# EAGLE design reflow_ofen (EAGLE 6.4)
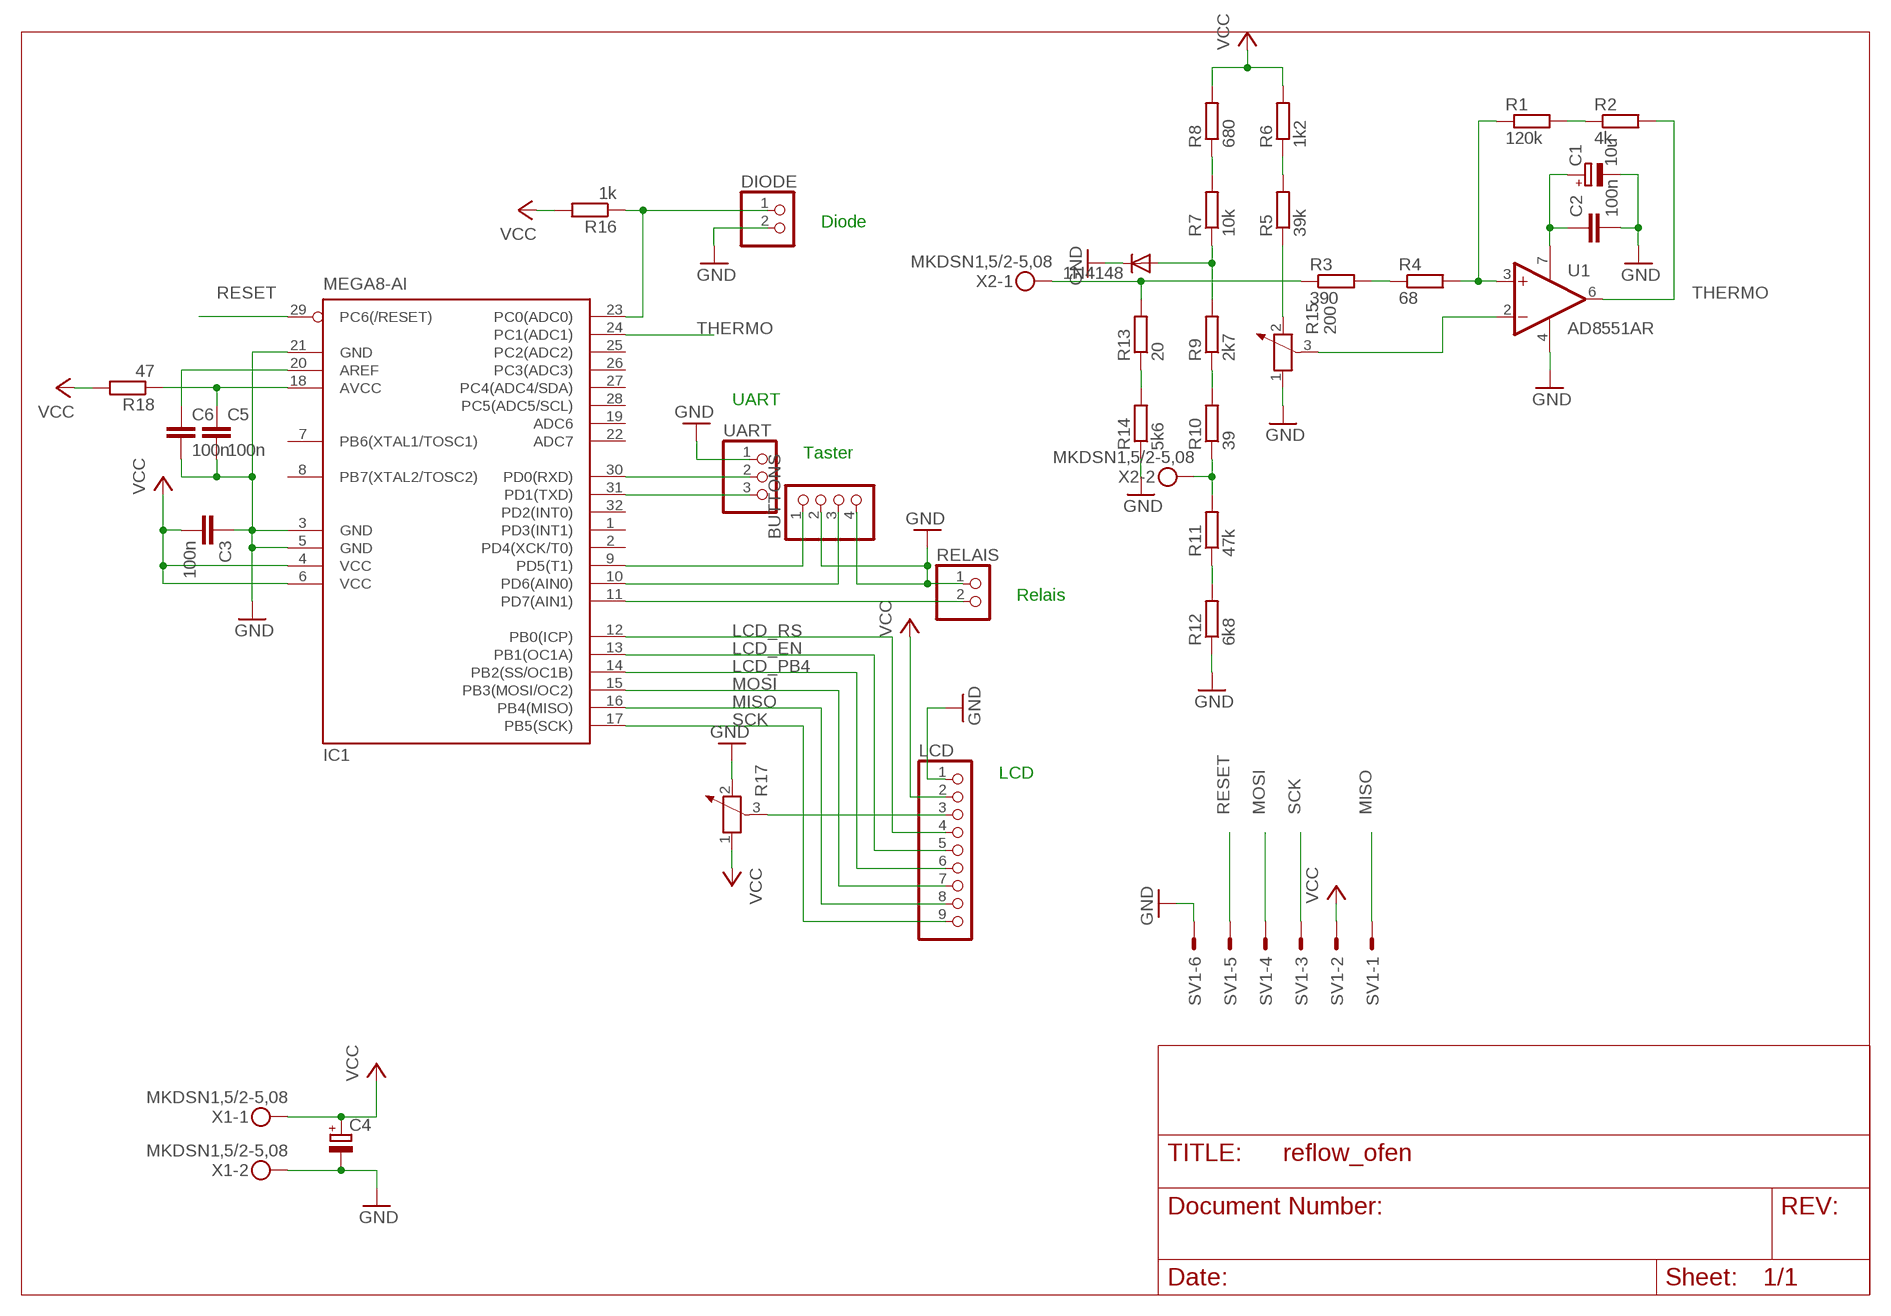
[diagram p0: schematic, sheet 1]

## Parts
1N4148  DIODE-SOD80C  [SOD80C]
BUTTONS  PINHD-1X4  [1X04]
C1  10u  CPOL-EU153CLV-0405  [153CLV-0405]
C2  100n  C-EUC0805  [C0805]
C3  100n  C-EUC0805  [C0805]
C4  CPOL-EU153CLV-0505  [153CLV-0505]
C5  100n  C-EUC0805  [C0805]
C6  100n  C-EUC0805  [C0805]
DIODE  PINHD-1X2  [1X02]
IC1  MEGA8-AI  [TQFP32-08]
LCD  PINHD-1X9  [1X09]
R1  120k  R-EU_R0805  [R0805]
R2  4k  R-EU_R0805  [R0805]
R3  390  R-EU_R0805  [R0805]
R4  68  R-EU_R0805  [R0805]
R5  39k  R-EU_R0805  [R0805]
R6  1k2  R-EU_R0805  [R0805]
R7  10k  R-EU_R0805  [R0805]
R8  680  R-EU_R0805  [R0805]
R9  2k7  R-EU_R0805  [R0805]
R10  39  R-EU_R0805  [R0805]
R11  47k  R-EU_R0805  [R0805]
R12  6k8  R-EU_R0805  [R0805]
R13  20  R-EU_R0805  [R0805]
R14  5k6  R-EU_R0805  [R0805]
R15  200  POTENTIOMETER_PT-10  [PT-10]
R16  1k  R-EU_R0805  [R0805]
R17  POTENTIOMETER_PT-10  [PT-10]
R18  47  R-EU_R0805  [R0805]
RELAIS  PINHD-1X2  [1X02]
SV1  ML6E  [ML6]
U1  AD8551AR  [SO8]
UART  PINHD-1X3  [1X03]
X1  MKDSN1,5/2-5,08  [MKDSN1,5/2-5,08]
X2  MKDSN1,5/2-5,08  [MKDSN1,5/2-5,08]

## Nets
GND: 1N4148.C BUTTONS.2 BUTTONS.4 C1.- C2.2 C3.1 C4.- C5.2 C6.2 DIODE.2 IC1.3(GND) IC1.5(GND) IC1.21(GND) LCD.1 R12.1 R14.1 R15.1 R17.2 RELAIS.1 SV1.6 U1.4(GND) UART.1 X1.2
LCD_EN: IC1.13(PB1(OC1A)) LCD.5
LCD_PB4: IC1.14(PB2(SS/OC1B)) LCD.6
LCD_RS: IC1.12(PB0(ICP)) LCD.4
MISO: IC1.16(PB4(MISO)) LCD.8 SV1.1
MOSI: IC1.15(PB3(MOSI/OC2)) LCD.7 SV1.4
N$1: R1.1 R4.2 U1.3(+IN)
N$2: R3.2 R4.1
N$3: R15.3 U1.2(-IN)
N$4: R5.1 R15.2
N$5: R5.2 R6.1
N$6: DIODE.1 IC1.23(PC0(ADC0)) R16.1
N$7: R7.2 R8.1
N$8: 1N4148.A R7.1 R9.2
N$9: R9.1 R10.2
N$10: R10.1 R11.2 X2.2
N$11: R11.1 R12.2
N$12: R3.1 R13.2 X2.1
N$13: R13.1 R14.2
N$14: IC1.31(PD1(TXD)) UART.3
N$15: R1.2 R2.1
N$16: IC1.30(PD0(RXD)) UART.2
N$17: C1.+ C2.1 U1.7(V+)
N$18: IC1.11(PD7(AIN1)) RELAIS.2
N$19: BUTTONS.3 IC1.10(PD6(AIN0))
N$20: BUTTONS.1 IC1.9(PD5(T1))
N$22: LCD.3 R17.3
N$24: C5.1 IC1.18(AVCC) R18.1
N$25: C6.1 IC1.20(AREF)
RESET: IC1.29(PC6(/RESET)) SV1.5
SCK: IC1.17(PB5(SCK)) LCD.9 SV1.3
THERMO: IC1.24(PC1(ADC1)) R2.2 U1.6(OUT)
VCC: C3.2 C4.+ IC1.4(VCC) IC1.6(VCC) LCD.2 R6.2 R8.2 R16.2 R17.1 R18.2 SV1.2 X1.1
Unconnected: IC1.1(PD3(INT1)) IC1.2(PD4(XCK/T0)) IC1.7(PB6(XTAL1/TOSC1)) IC1.8(PB7(XTAL2/TOSC2)) IC1.19(ADC6) IC1.22(ADC7) IC1.25(PC2(ADC2)) IC1.26(PC3(ADC3)) IC1.27(PC4(ADC4/SDA)) IC1.28(PC5(ADC5/SCL)) IC1.32(PD2(INT0))

## Notes on the sheet
- Diode
- UART
- Taster
- Relais
- LCD

## Library data of the parts
1N4148 = diode:DIODE-: DIODE
BUTTONS = pinhead:PINHD-1X4: PIN HEADER
C1 C4 = rcl:CPOL-EU: POLARIZED CAPACITOR, European symbol
C2 C3 C5 C6 = rcl:C-EU: CAPACITOR, European symbol
DIODE RELAIS = pinhead:PINHD-1X2: PIN HEADER
IC1 = atmel:MEGA8: MICROCONTROLLER 8 Kbytes FLASH, 1 kbytes SRAM, 512 bytes EEPROM, USART, 6-channel 10 bit ADC, 2-channel 8 bit ADC Pin compatible with Atmega48, ATMega88, ATMega168 Source: avr.lbr; MPN: ATMEGA8-16AU; OC_FARNELL: 9171371; OC_NEWARK: 73M8863
LCD = pinhead:PINHD-1X9: PIN HEADER
R1-R14 R16 R18 = rcl:R-EU_: RESISTOR, European symbol
R15 R17 = rcl:POTENTIOMETER_: Potentiometer
SV1 = con-ml:ML6E: HARTING; OC_FARNELL: unknown; OC_NEWARK: unknown
U1 = analog-devices2:AD8551*: 1x Operational Amplifiers, Zero-Drift, Single-Supply, Rail-to-Rail Input/Output
UART = pinhead:PINHD-1X3: PIN HEADER
X1 X2 = con-phoenix-508:MKDSN1,5/2-5,08: MKDSN 1,5/ 2-5,08 Printklemme Nennstrom: 13,5 A Nennspannung: 250 V Rastermaß: 5,08 mm Polzahl: 2 Anschlussart: Schraubanschluss Montage: Löten Anschlussrichtung Leiter/Platine: 0 ° Artikelnummer: 1729128 Source: http://eshop.phoenixcontact.com .. 1729128.pdf; MPN: MKDSN 1,5/2-5.08; OC_FARNELL: 1792903; OC_NEWARK: 30M2397

## Board
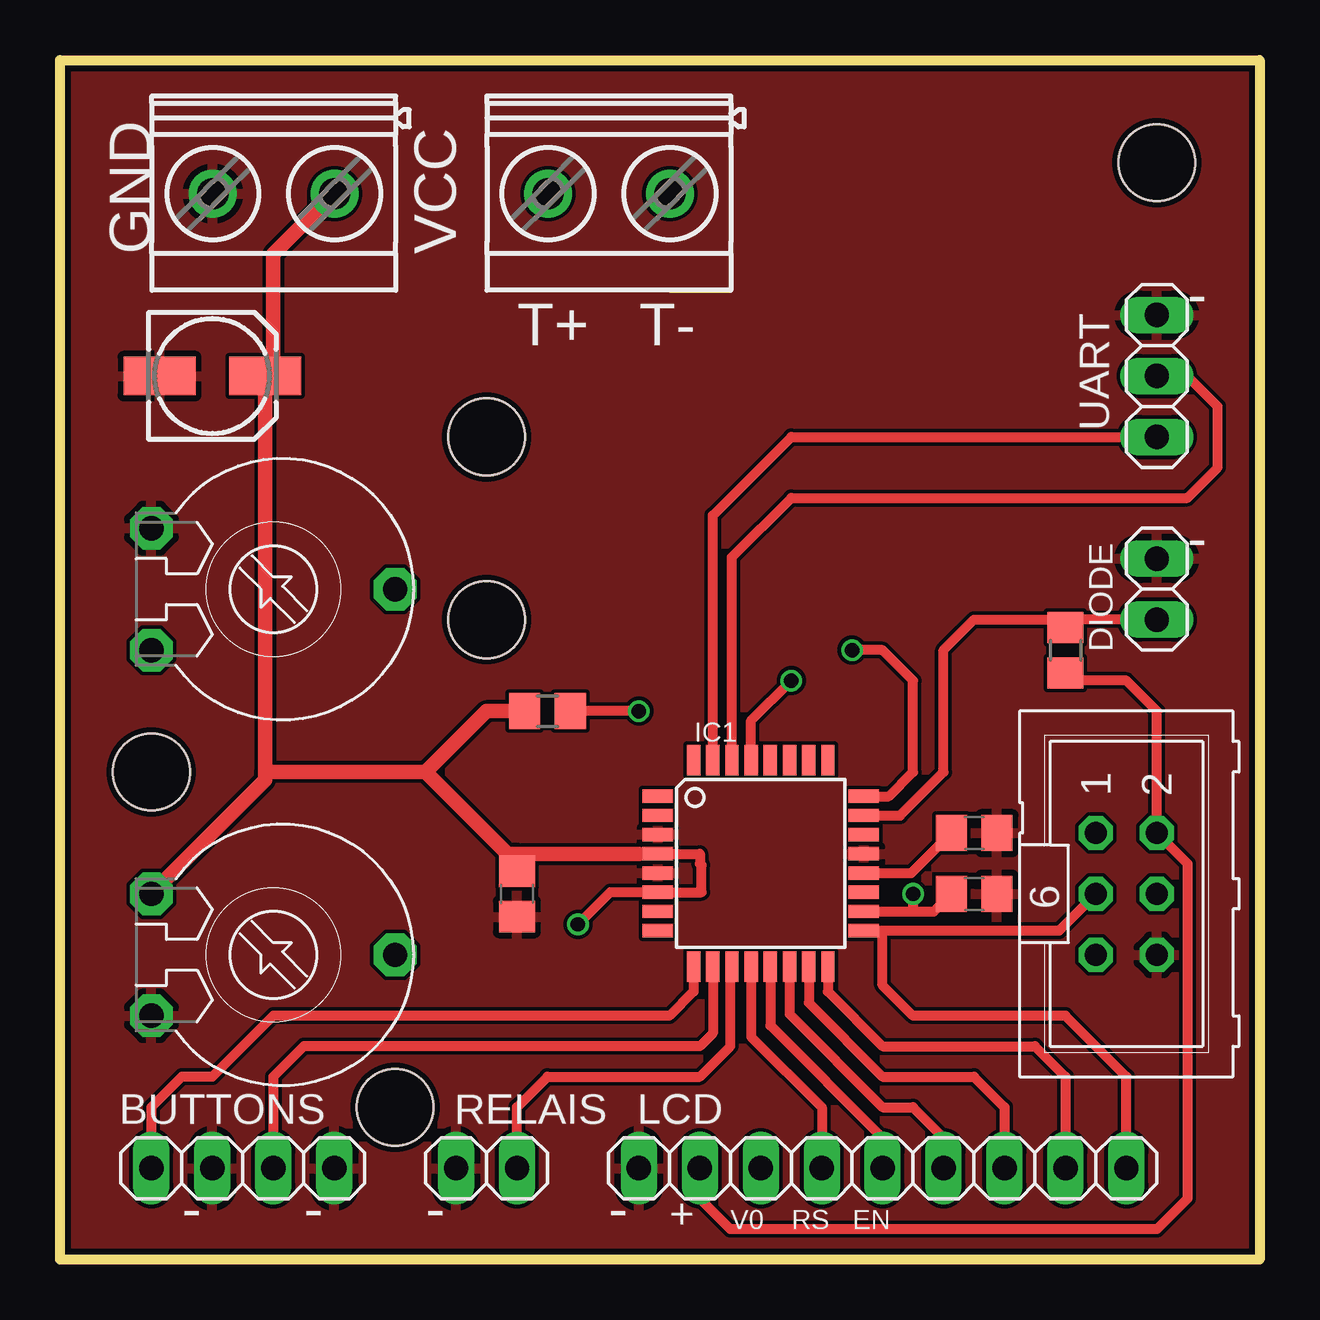
[diagram p1: board, top side]
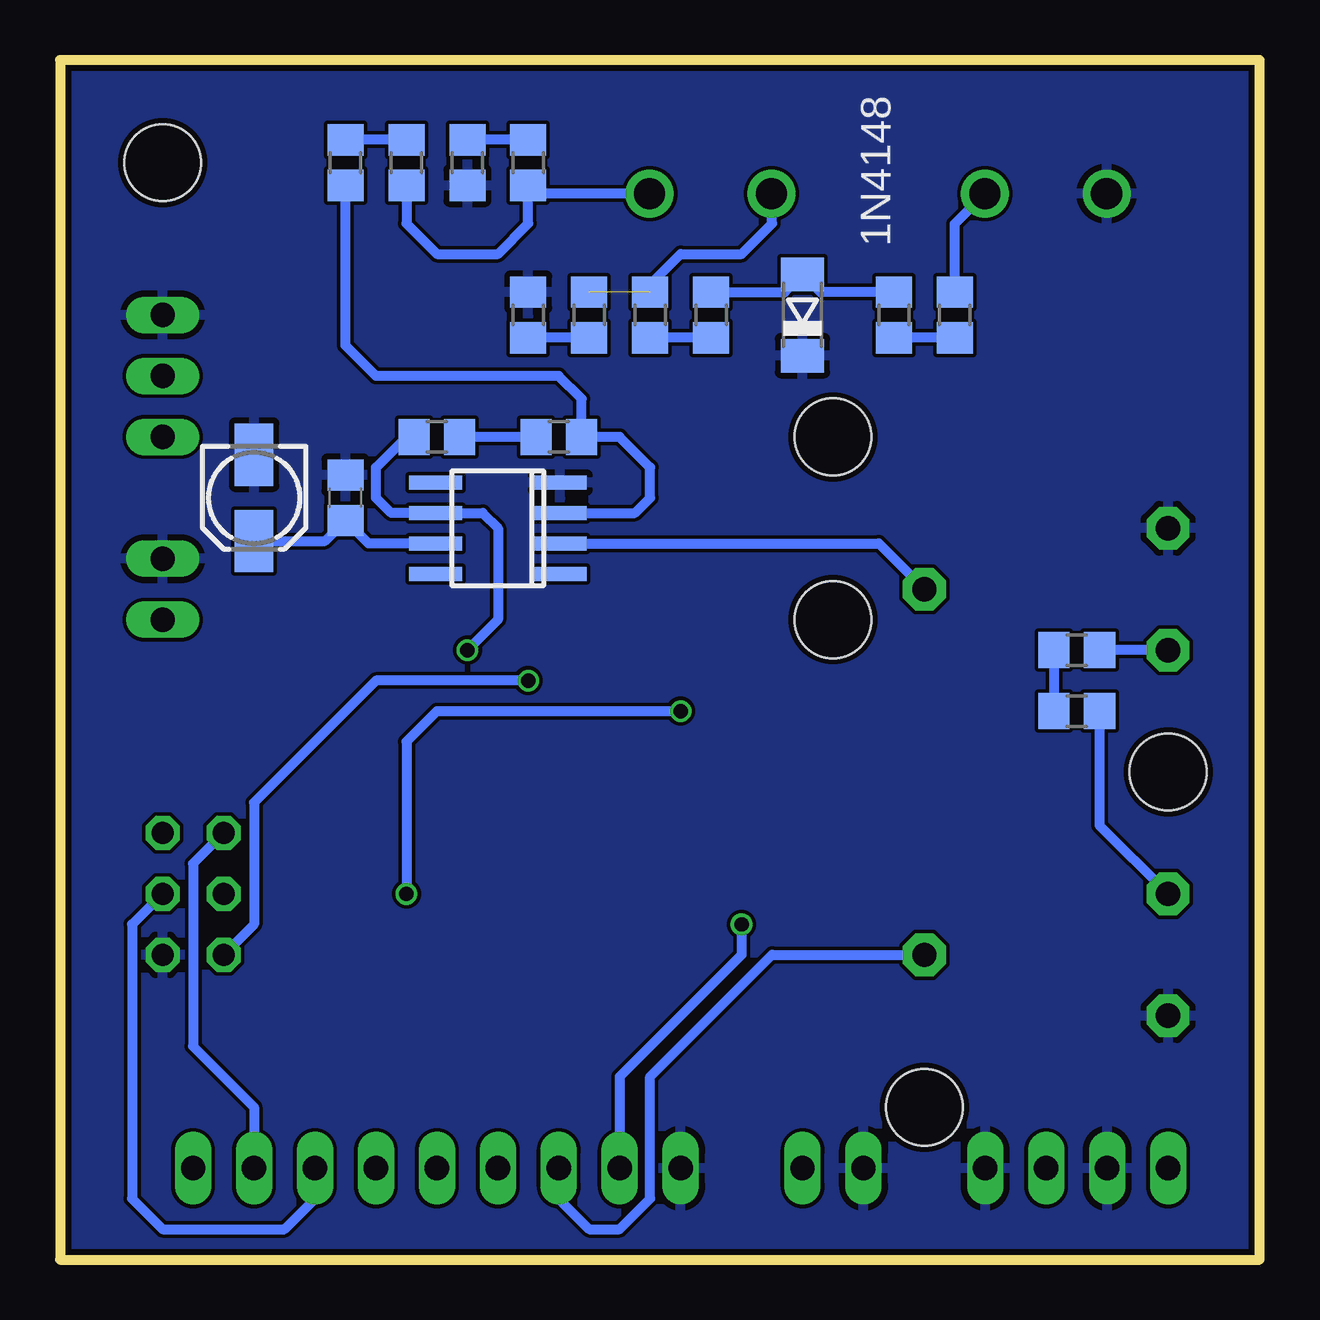
[diagram p2: board, bottom side, seen from below]

Size 50 x 50 mm. Coordinates in mm from the lower left corner, seen from the top.
Outline: 0,0 0,50 50,50 50,0 0,0
Copper layers (1*16): Top 0.035mm / dielectric 1.5mm / Bottom 0.035mm
Design rules "SeeedStudio_2layer_DRU_no_angle_20140221": minimum track width 6mil, minimum drill 12mil, track to track 6mil, track to pad 6mil, pad to pad 6mil, via to via 6mil, smd to smd 0mil, copper to edge 10mil, drill to drill 10mil, minimum pad ring 10mil, minimum via ring 6mil, stop-mask expansion 2mil, vias tented up to drill 100mil, thermal gap 10mil
Holes 3.2 mm at 45.72,45.72 17.78,34.29 17.78,26.67 3.81,20.32 13.97,6.35

### Footprints (pad centres in the part's own frame; a part is rotated, then mirrored left to right if it is on the bottom)
SOD80C = smd 1.4 x 1.8: A 1.7,0; C -1.7,0
1X04 = drill 1.016 long: 1 -3.81,0; 2 -1.27,0; 3 1.27,0; 4 3.81,0
153CLV-0405 = smd 2.6 x 1.6: + 1.8,0; - -1.8,0
C0805 = smd 1.3 x 1.5: 1 -0.95,0; 2 0.95,0
153CLV-0505 = smd 3 x 1.6: + 2.2,0; - -2.2,0
1X02 = drill 1.016 long: 1 -1.27,0; 2 1.27,0
TQFP32-08 = smd 1.27 x 0.559: 1 -4.293,2.8; 2 -4.293,2; 3 -4.293,1.2; 4 -4.293,0.4; 5 -4.293,-0.4; 6 -4.293,-1.2; 7 -4.293,-2; 8 -4.293,-2.8; 17 4.293,-2.8; 18 4.293,-2; 19 4.293,-1.2; 20 4.293,-0.4; 21 4.293,0.4; 22 4.293,1.2; 23 4.293,2; 24 4.293,2.8 | smd 0.559 x 1.27: 9 -2.8,-4.293; 10 -2,-4.293; 11 -1.2,-4.293; 12 -0.4,-4.293; 13 0.4,-4.293; 14 1.2,-4.293; 15 2,-4.293; 16 2.8,-4.293; 25 2.8,4.293; 26 2,4.293; 27 1.2,4.293; 28 0.4,4.293; 29 -0.4,4.293; 30 -1.2,4.293; 31 -2,4.293; 32 -2.8,4.293
1X09 = drill 1.016 long: 1 -10.16,0; 2 -7.62,0; 3 -5.08,0; 4 -2.54,0; 5 0,0; 6 2.54,0; 7 5.08,0; 8 7.62,0; 9 10.16,0
R0805 = smd 1.3 x 1.5: 1 -0.95,0; 2 0.95,0
PT-10 = drill 1.016 pad 1.778 octagon: 1 -2.54,-5.08; 2 2.54,-5.08; 3 0,5.08
ML6 = drill 0.914 octagon: 1 -2.54,-1.27; 2 -2.54,1.27; 3 0,-1.27; 4 0,1.27; 5 2.54,-1.27; 6 2.54,1.27
SO8 = smd 0.6 x 2.2: 1 -1.905,-2.6; 2 -0.635,-2.6; 3 0.635,-2.6; 4 1.905,-2.6; 5 1.905,2.6; 6 0.635,2.6; 7 -0.635,2.6; 8 -1.905,2.6
1X03 = drill 1.016 long: 1 -2.54,0; 2 0,0; 3 2.54,0
MKDSN1,5/2-5,08 = drill 1.3 pad 2: 1 -2.561,0.025; 2 2.519,0.025

### Placement (x,y rotation side)
1N4148  19.05,39.37 90 bottom
BUTTONS  7.62,3.81 0 top
C1  41.91,31.75 270 bottom
C2  38.1,31.75 90 bottom
C3  19.05,15.24 90 top
C4  6.35,36.83 0 top
C5  38.1,15.24 0 top
C6  38.1,17.78 0 top
DIODE  45.72,27.94 90 top
IC1  29.21,16.51 0 top
LCD  34.29,3.81 0 top
R1  29.21,34.29 180 bottom
R2  34.29,34.29 180 bottom
R3  35.56,45.72 90 bottom
R4  38.1,45.72 270 bottom
R5  7.62,25.4 180 bottom
R6  7.62,22.86 0 bottom
R7  15.24,39.37 270 bottom
R8  12.7,39.37 90 bottom
R9  22.86,39.37 90 bottom
R10  25.4,39.37 270 bottom
R11  27.94,39.37 90 bottom
R12  30.48,39.37 270 bottom
R13  30.48,45.72 270 bottom
R14  33.02,45.72 90 bottom
R15  8.89,27.94 270 top
R16  41.91,25.4 270 top
R17  8.89,12.7 270 top
R18  20.32,22.86 180 top
RELAIS  17.78,3.81 0 top
SV1  44.45,15.24 270 top
U1  31.75,30.48 90 bottom
UART  45.72,36.83 270 top
X1  8.89,44.45 180 top
X2  22.86,44.45 180 top

### Tracks (layer width: path | path; a pad name or v marks a point on that pad's centre or on a via)
GND
  pour Top: 0,0 0,50 50,50 50,0
  pour Bottom: 0,0 0,50 50,50 50,0
LCD_EN
  Top 0.406: IC1.13 29.61,9.76 34.29,5.08 LCD.5
LCD_PB4
  Top 0.406: LCD.6 36.83,5.08 35.56,6.35 34.29,6.35 30.41,10.23 IC1.14
LCD_RS
  Top 0.406: IC1.12 28.81,9.29 31.75,6.35 LCD.4
MISO
  Top 0.406: IC1.16 32.01,11.17 34.29,8.89 40.64,8.89 41.91,7.62 LCD.8
  Bottom 0.406: SV1.1 44.45,16.51 44.45,8.89 41.91,6.35 LCD.8
MOSI
  Top 0.406: IC1.15 31.21,10.7 34.29,7.62 38.1,7.62 39.37,6.35 LCD.7
  Bottom 0.406: SV1.4 46.99,13.97 46.99,2.54 45.72,1.27 40.64,1.27 39.37,2.54 LCD.7
N$1
  Bottom 0.406: U1.3 26.04,31.11 25.4,31.75 25.4,33.02 26.67,34.29 R1.1 28.26,35.88 29.21,36.83 36.83,36.83 38.1,38.1 R4.2
N$2
  Bottom 0.406: R3.2 R4.1
N$3
  Bottom 0.406: U1.2 15.88,29.84 R15.3
N$4
  Bottom 0.406: R15.2 R5.1
N$5
  Bottom 0.406: R5.2 R6.1
N$6
  Top 0.406: IC1.23 35.02,18.51 36.83,20.32 36.83,25.4 38.1,26.67 41.59,26.67 R16.1 42.23,26.67 DIODE.1
N$7
  Bottom 0.406: R8.1 R7.2
N$8
  Bottom 0.406: R7.1 18.3,40.32 1N4148.A 19.8,40.32 R9.2
N$9
  Bottom 0.406: R9.1 R10.2
N$10  (1 unrouted)
  Bottom 0.406: R10.1 25.4,40.64 24.13,41.91 21.59,41.91 20.32,43.18 20.32,44.4 X2.2
N$11
  Bottom 0.406: R11.1 R12.2
N$12
  Bottom 0.406: X2.1 30.14,44.42 R13.2 30.48,43.18 31.75,41.91 34.29,41.91 35.56,43.18 R3.1
N$13
  Bottom 0.406: R13.1 R14.2
N$14
  Top 0.406: IC1.31 27.21,31.02 30.48,34.29 UART.3
N$15
  Bottom 0.406: R1.2 R2.1
N$16
  Top 0.406: IC1.30 28.01,29.28 30.48,31.75 46.99,31.75 48.26,33.02 48.26,35.56 46.99,36.83 UART.2
N$17
  Bottom 0.406: U1.7 37.15,29.84 C2.1 38.95,29.95 C1.+
N$18
  Top 0.406: RELAIS.2 19.05,6.35 20.32,7.62 26.67,7.62 27.94,8.89 27.94,12.15 IC1.11
N$19
  Top 0.406: IC1.10 27.21,9.43 26.67,8.89 10.16,8.89 8.89,7.62 BUTTONS.3
N$20
  Top 0.406: IC1.9 26.41,11.17 25.4,10.16 8.89,10.16 6.35,7.62 5.08,7.62 3.81,6.35 BUTTONS.1
N$22
  Bottom 0.406: LCD.3 29.21,2.54 27.94,1.27 26.67,1.27 25.4,2.54 25.4,7.62 20.32,12.7 R17.3
N$24  (via drill 0.6)
  Top 0.406: IC1.18 35.56,14.51 | 35.56,14.51 36.42,14.51 C5.1 | v35.56,15.24 35.56,14.51 | v24.13,22.86 R18.1
  Bottom 0.406: v35.56,15.24 35.56,21.59 34.29,22.86 v24.13,22.86
N$25
  Top 0.406: IC1.20 35.48,16.11 C6.1
RESET  (via drill 0.6)
  Top 0.406: IC1.29 28.81,22.46 v30.48,24.13
  Bottom 0.406: SV1.5 41.91,13.97 41.91,19.05 36.83,24.13 v30.48,24.13
SCK
  Top 0.406: IC1.17 34.29,13.71 | 34.29,13.71 41.65,13.71 SV1.3 | LCD.9 44.45,7.62 41.91,10.16 35.56,10.16 34.29,11.43 34.29,13.71
THERMO  (via drill 0.6)
  Top 0.406: IC1.24 34.55,19.31 35.56,20.32 35.56,24.13 34.29,25.4 v33.02,25.4
  Bottom 0.406: R2.2 35.56,34.29 36.83,33.02 36.83,31.75 36.2,31.11 U1.6 32.38,31.11 31.75,30.48 31.75,26.67 v33.02,25.4
VCC  (via drill 0.6)
  Top 0.406: 19.77,16.91 24.13,16.91 IC1.4 26.67,16.91 26.67,16.51 26.74,16.44 26.74,15.31 IC1.6 22.93,15.31 v21.59,13.97 | C3.2 19.05,16.91 | LCD.2 26.67,2.54 27.94,1.27 45.72,1.27 46.99,2.54 46.99,16.51 SV1.2 45.72,22.86 44.45,24.13 42.23,24.13 R16.2
  Top 0.61: X1.1 11.4,44.42 8.89,41.91 8.89,37.17 C4.+ | C4.+ 8.89,36.83 | 15.24,20.32 18.65,16.91 19.05,16.91 24.13,16.91 | C4.+ 8.55,20.32 | 8.55,20.32 8.55,19.98 R17.1 | 15.24,20.32 8.55,20.32 | R18.2 17.78,22.86 15.24,20.32
  Bottom 0.406: v21.59,13.97 21.59,12.7 26.67,7.62 LCD.2 | R8.2 12.7,43.18 X1.1 | R17.1 6.67,18.1 R6.2

### Text on the board
tNames: GND | VCC | - | T+ | T- | - | - | - | - | - | + | V0 | RS | EN
bValues: 68